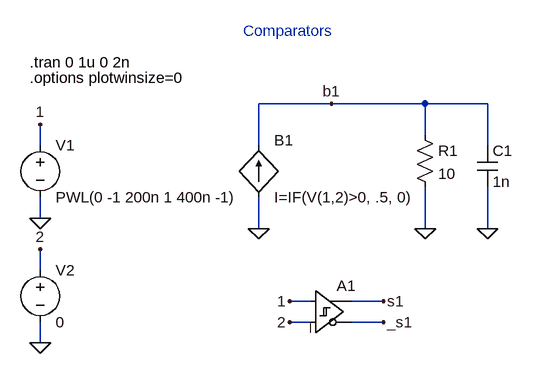
[diagram p0: schematic Comparator2.asc]
Comparator2.asc, the LTspice schematic file:
Version 4
SHEET 1 880 680
WIRE 0 96 -112 96
WIRE 144 96 0 96
WIRE 240 96 144 96
WIRE 144 144 144 96
WIRE -448 160 -448 128
WIRE -112 160 -112 96
WIRE 240 160 240 96
WIRE -448 272 -448 240
WIRE -112 288 -112 240
WIRE 144 288 144 224
WIRE 240 288 240 224
WIRE -448 352 -448 320
WIRE -32 400 -64 400
WIRE 80 400 32 400
WIRE -32 432 -64 432
WIRE 80 432 32 432
WIRE -448 464 -448 432
FLAG -112 288 0
FLAG 144 288 0
FLAG 240 288 0
FLAG -448 272 0
FLAG -64 432 2
FLAG -64 400 1
FLAG -448 128 1
FLAG -448 464 0
FLAG -448 320 2
FLAG 80 400 s1
FLAG 80 432 _s1
FLAG 0 96 b1
SYMBOL bi -112 240 M180
WINDOW 0 24 88 Left 0
WINDOW 3 24 0 Left 0
SYMATTR InstName B1
SYMATTR Value I=IF(V(1,2)>0, .5, 0)
SYMBOL res 128 128 R0
SYMATTR InstName R1
SYMATTR Value 10
SYMBOL cap 224 160 R0
SYMATTR InstName C1
SYMATTR Value 1n
SYMBOL Digital\\diffschmitt -32 352 R0
SYMATTR InstName A1
SYMATTR Value2 Vhigh=5 trise=10n
SYMATTR SpiceLine Vt=0 Vh=1m
SYMBOL voltage -448 144 R0
WINDOW 123 0 0 Left 0
WINDOW 39 0 0 Left 0
SYMATTR InstName V1
SYMATTR Value PWL(0 -1 200n 1 400n -1)
SYMBOL voltage -448 336 R0
WINDOW 123 0 0 Left 0
WINDOW 39 0 0 Left 0
SYMATTR InstName V2
SYMATTR Value 0
TEXT -464 32 Left 0 !.tran 0 1u 0 2n
TEXT -464 56 Left 0 !.options plotwinsize=0
TEXT -136 -16 Left 0 ;Comparators

The netlist it stands for:
* Comparator2.asc
B1 0 b1 I=IF(V(1,2)>0, .5, 0)
R1 b1 0 10
C1 b1 0 1n
A1 1 2 0 0 0 _s1 s1 0 SCHMITT Vhigh=5 trise=10n Vt=0 Vh=1m
V1 1 0 PWL(0 -1 200n 1 400n -1)
V2 2 0 0
.tran 0 1u 0 2n
.options plotwinsize=0
* Comparators
.backanno
.end